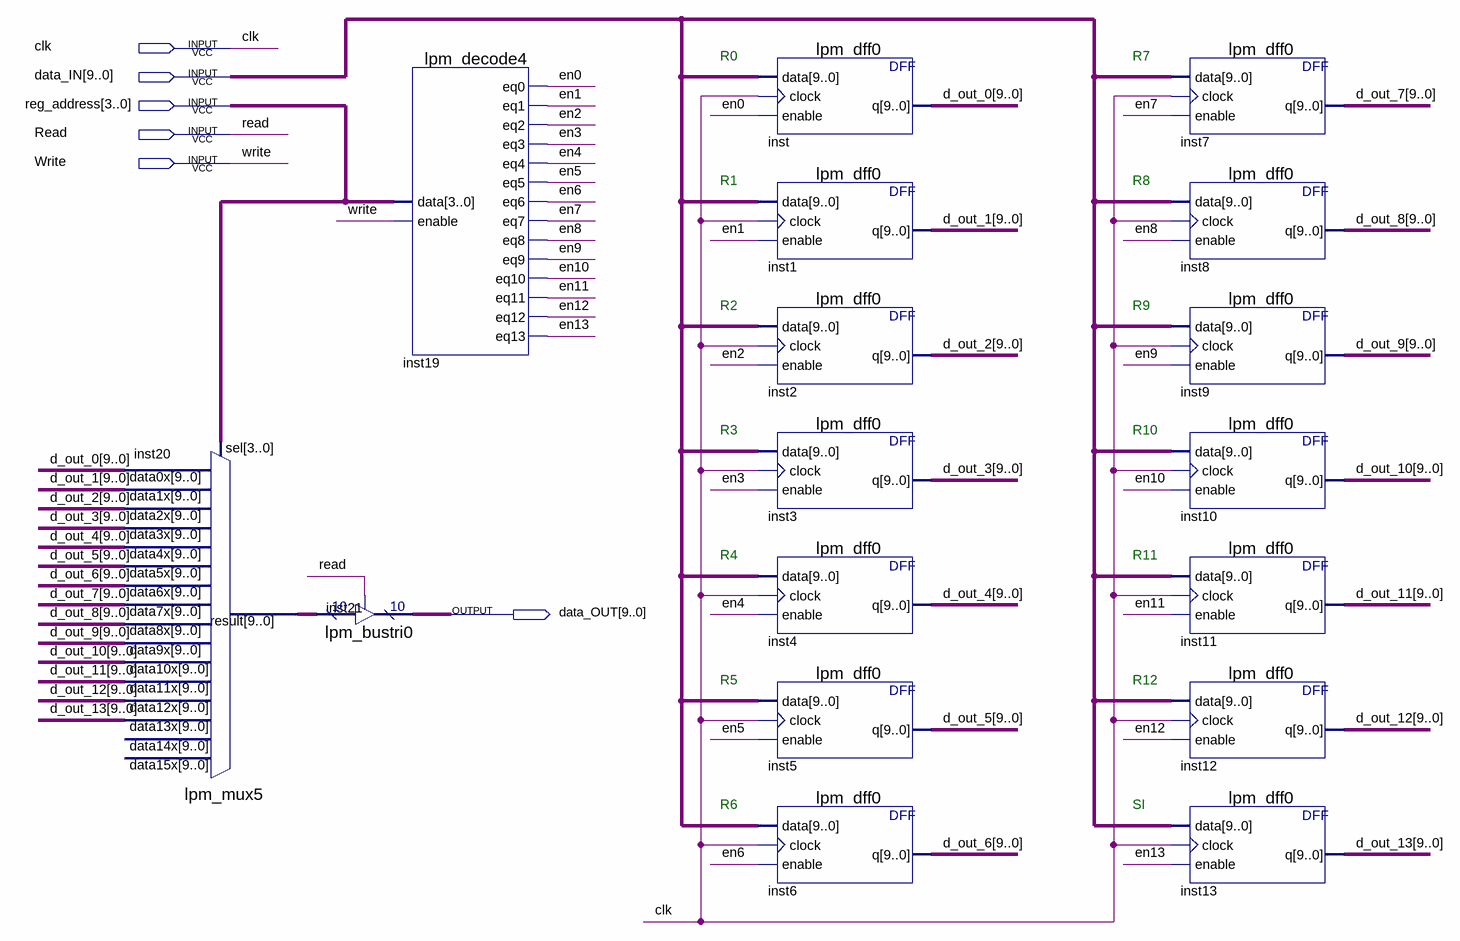
[diagram p0: schematic sheet]
// Quartus schematic RON_Block.bdf as structural Verilog: 17 symbols, 6 pins
module RON_Block (
  input  clk,
  input  [9:0] data_IN,
  input  [3:0] reg_address,
  input  Read,
  input  Write,
  output [9:0] data_OUT
);

  wire en0, en1, en2, en3, en4, en5, en6, en7, en8, en9, en10, en11, en12, en13;
  wire [9:0] d_out_0, d_out_1, d_out_2, d_out_3, d_out_4, d_out_5, d_out_6, d_out_7, d_out_8, d_out_9,
       d_out_10, d_out_11, d_out_12, d_out_13, inst20_result;

  lpm_mux5 inst20 (
    .data13x(d_out_13), .data12x(d_out_12), .data11x(d_out_11), .data10x(d_out_10), .data9x(d_out_9),
    .data8x(d_out_8), .data7x(d_out_7), .data6x(d_out_6), .data5x(d_out_5), .data4x(d_out_4),
    .data3x(d_out_3), .data2x(d_out_2), .data1x(d_out_1), .data0x(d_out_0), .sel(reg_address),
    .result(inst20_result));  // open: data15x, data14x
  lpm_bustri0 inst21 (.enabledt(Read), .data(inst20_result), .tridata(data_OUT));
  lpm_decode4 inst19 (
    .data(reg_address), .enable(Write), .eq0(en0), .eq1(en1), .eq2(en2), .eq3(en3), .eq4(en4), .eq5(en5),
    .eq6(en6), .eq7(en7), .eq8(en8), .eq9(en9), .eq10(en10), .eq11(en11), .eq12(en12), .eq13(en13));
  lpm_dff0 inst (.data(data_IN), .clock(clk), .enable(en0), .q(d_out_0));
  lpm_dff0 inst1 (.data(data_IN), .clock(clk), .enable(en1), .q(d_out_1));
  lpm_dff0 inst2 (.data(data_IN), .clock(clk), .enable(en2), .q(d_out_2));
  lpm_dff0 inst3 (.data(data_IN), .clock(clk), .enable(en3), .q(d_out_3));
  lpm_dff0 inst4 (.data(data_IN), .clock(clk), .enable(en4), .q(d_out_4));
  lpm_dff0 inst5 (.data(data_IN), .clock(clk), .enable(en5), .q(d_out_5));
  lpm_dff0 inst6 (.data(data_IN), .clock(clk), .enable(en6), .q(d_out_6));
  lpm_dff0 inst7 (.data(data_IN), .clock(clk), .enable(en7), .q(d_out_7));
  lpm_dff0 inst8 (.data(data_IN), .clock(clk), .enable(en8), .q(d_out_8));
  lpm_dff0 inst9 (.data(data_IN), .clock(clk), .enable(en9), .q(d_out_9));
  lpm_dff0 inst10 (.data(data_IN), .clock(clk), .enable(en10), .q(d_out_10));
  lpm_dff0 inst11 (.data(data_IN), .clock(clk), .enable(en11), .q(d_out_11));
  lpm_dff0 inst12 (.data(data_IN), .clock(clk), .enable(en12), .q(d_out_12));
  lpm_dff0 inst13 (.data(data_IN), .clock(clk), .enable(en13), .q(d_out_13));

  // Notes on the sheet:
  //   R0
  //   R7
  //   R1
  //   R8
  //   R2
  //   R9
  //   R3
  //   R10
  //   R4
  //   R11
  //   R5
  //   R12
  //   R6
  //   SI
endmodule
